# EAGLE schematic tsal (1) (EAGLE 9.6.1)
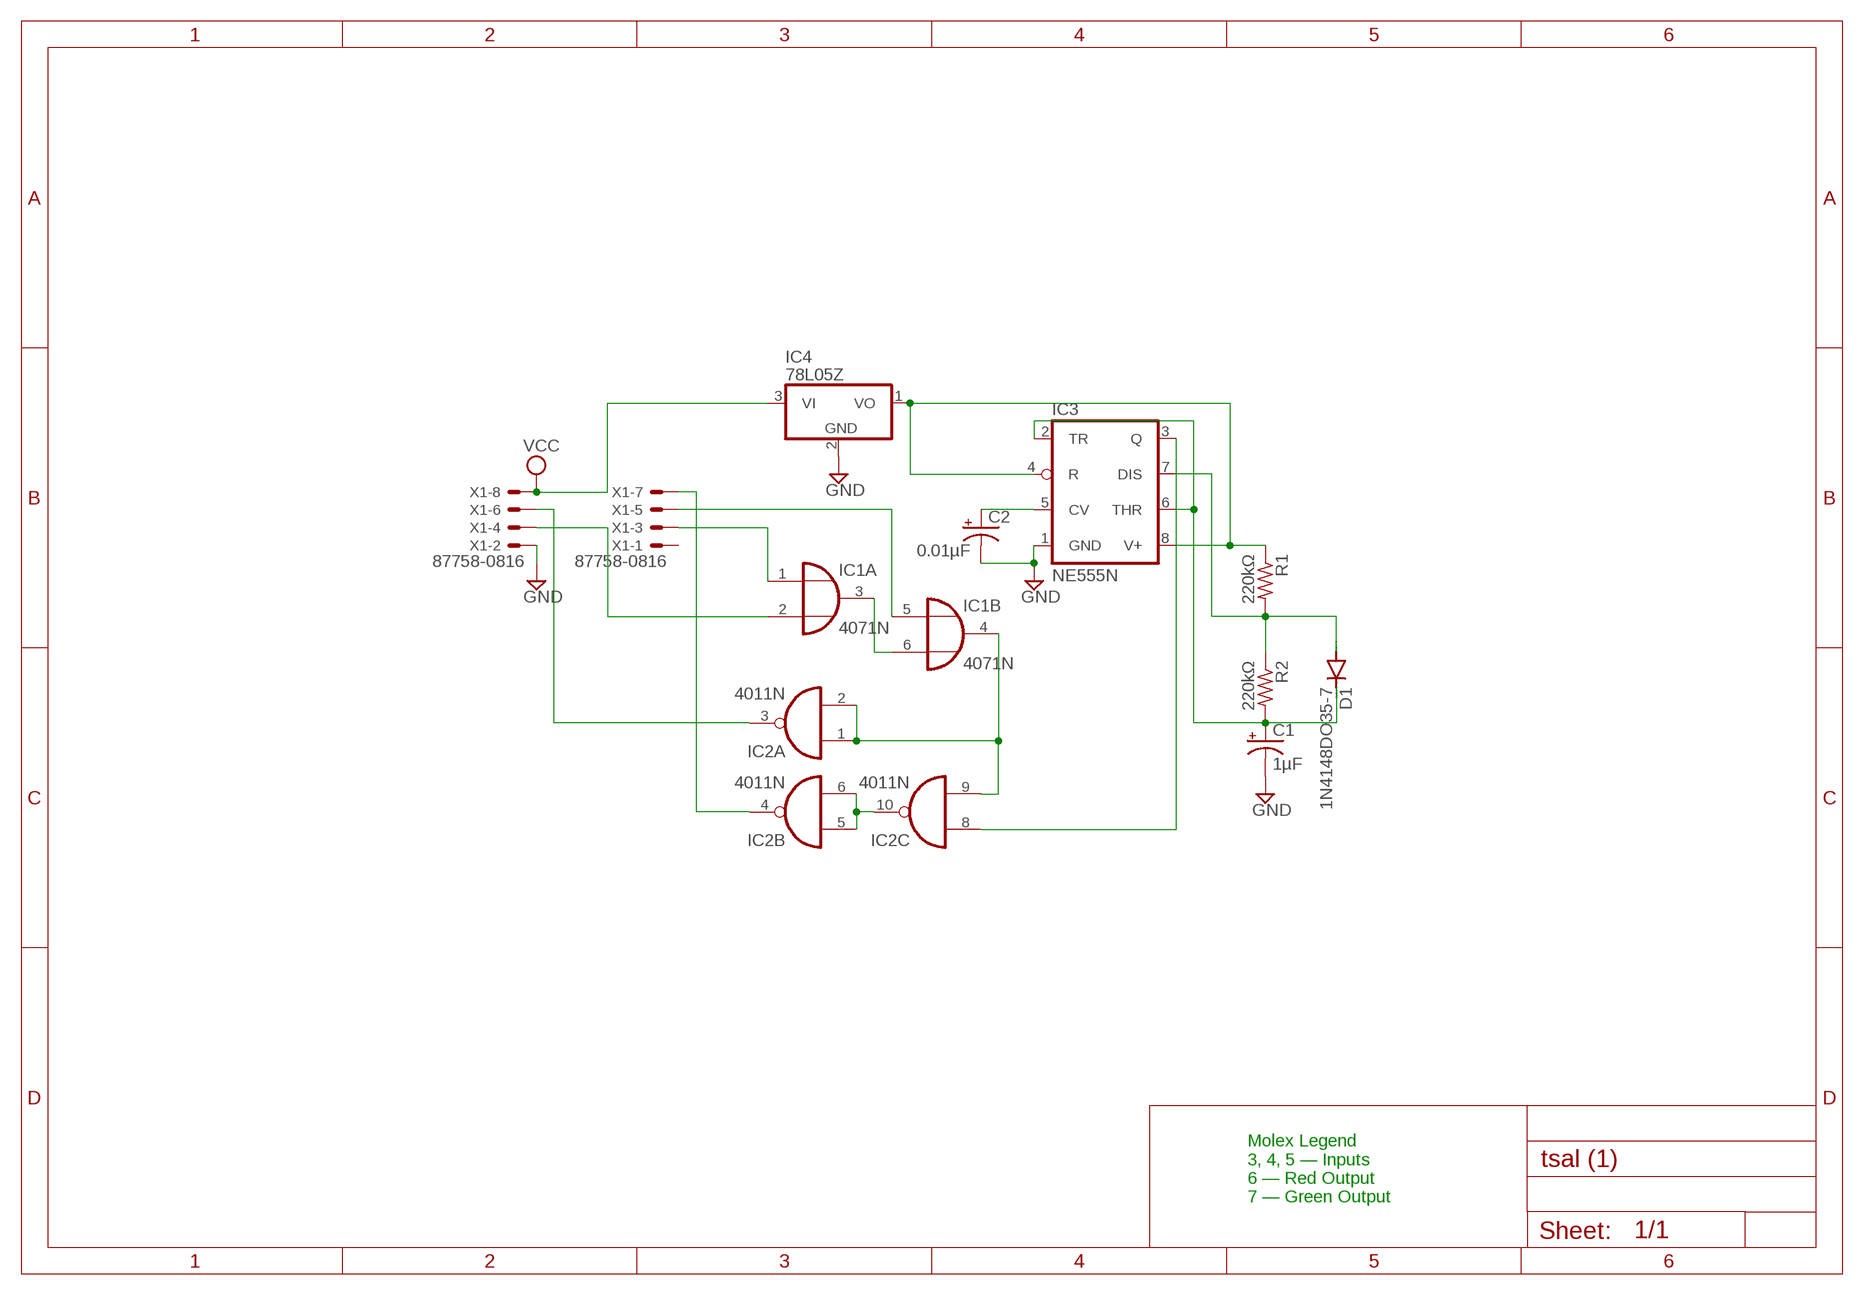
[diagram p0: schematic, sheet 1]

## Parts
C1  1µF  CPOL-USE1.8-4  [E1,8-4]
C2  0.01µF  CPOL-USE1.8-4  [E1,8-4]
D1  1N4148DO35-7  [DO35-7]
IC1  4071N  [DIL14]
IC2  4011N  [DIL14]
IC3  NE555N  [DIL08]
IC4  78L05Z  [TO92]
R1  220kΩ  R-US_0204/7  [0204/7]
R2  220kΩ  R-US_0204/7  [0204/7]
X1  87758-0816  [87758-0816]

## Nets
GND: C1.- C2.- IC3.1(GND) IC4.2(GND) X1.2
N$1: IC3.4(R) IC3.8(V+) IC4.1(VO) R1.1
N$2: IC1.1(A:I0) X1.3
N$3: IC1.2(A:I1) X1.4
N$4: IC1.3(A:O) IC1.6(B:I1)
N$5: IC1.5(B:I0) X1.5
N$6: IC1.4(B:O) IC2.1(A:I0) IC2.2(A:I1) IC2.9(C:I1)
N$7: IC2.3(A:O) X1.6
N$8: D1.A IC3.7(DIS) R1.2 R2.1
N$9: C1.+ D1.C IC3.2(TR) IC3.6(THR) R2.2
N$10: C2.+ IC3.5(CV)
N$11: IC2.5(B:I0) IC2.6(B:I1) IC2.10(C:O)
N$12: IC2.4(B:O) X1.7
N$13: IC2.8(C:I0) IC3.3(Q)
VCC: IC4.3(VI) X1.8
Unconnected: IC1.8(C:I0) IC1.9(C:I1) IC1.10(C:O) IC1.11(D:O) IC1.12(D:I0) IC1.13(D:I1) IC2.11(D:O) IC2.12(D:I0) IC2.13(D:I1) X1.1

## Notes on the sheet
- Molex Legend
  3, 4, 5 — Inputs
  6 — Red Output
  7 — Green Output

## Power pins joined to a net without a drawn wire
VDD: IC1.14(P:VDD) IC2.14(P:VDD)
VSS: IC1.7(P:VSS) IC2.7(P:VSS)

## Library data of the parts
C1 C2 = rcl:CPOL-US: POLARIZED CAPACITOR, American symbol; SPICEPREFIX: C
D1 = diode:1N4148: DIODE high speed (Philips)
IC1 = 40xx:4071: Quad 2-input OR
IC2 = 40xx:4011: Quad 2-input NAND
IC3 = linear:*555: TIMER
IC4 = linear:78*: Positive VOLTAGE REGULATOR Source: http://cache.national.com/ds/LM/LM78L05.pdf http://www.fairchildsemi.com/ds/LM/LM7805.pdf
R1 R2 = rcl:R-US_: RESISTOR, American symbol; SPICEPREFIX: R
X1 = con-molex:87758-0816: 8 Pin - 2mm Dual Row Single Wafer, Vertical T/H HDR Source: http://www.molex.com/pdm_docs/sd/877580616_sd.pdf; MF: MOLEX; MPN: 87758-0816; OC_FARNELL: 7472331; OC_NEWARK: 59J1556